# EAGLE schematic Detectielus schema (EAGLE 9.2.2)
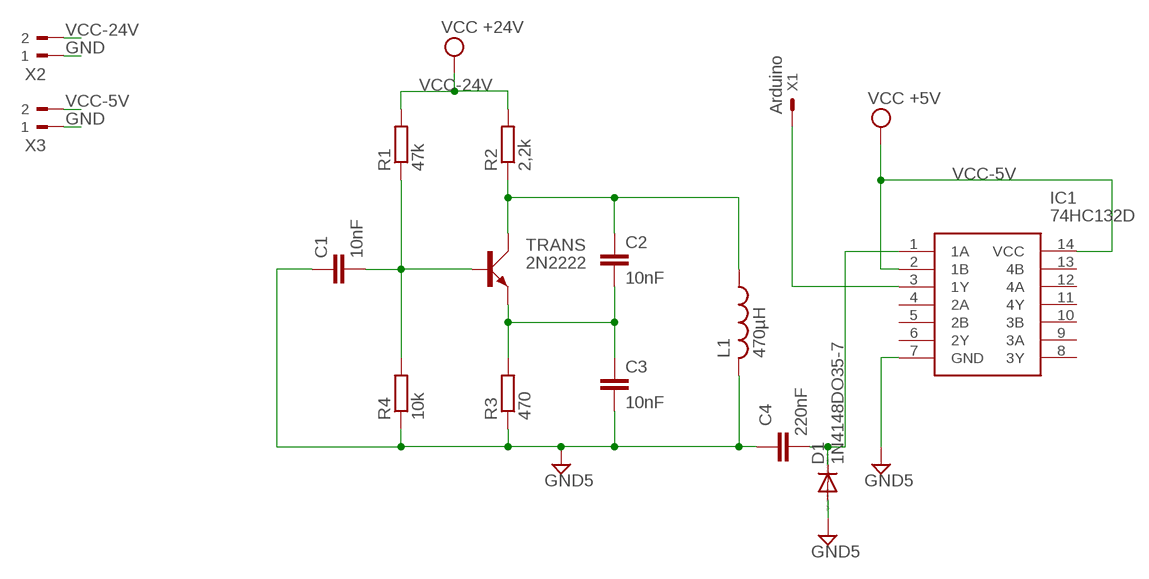
[diagram p0: schematic, sheet 1]

## Parts
C1  10nF  CAPACITOR  [C050-024X044]
C2  10nF  CAPACITOR  [C050-024X044]
C3  10nF  CAPACITOR  [C050-024X044]
C4  220nF  CAPACITOR  [C050-024X044]
D1  1N4148DO35-7  [DO35-7]
IC1  74HC132D  [SOIC127P600X175-14N]
L1  470µH  SPOEL  [IR-4]
R1  47k  RESISTOR  [RDH/15]
R2  2,2k  RESISTOR  [RDH/15]
R3  470  RESISTOR  [RDH/15]
R4  10k  RESISTOR  [RDH/15]
TRANS  2N2222  TIP41C  [TO220AV]
X1  Arduino  332-02  [332-02]
X2  90-2  [90-2]
X3  90-2  [90-2]

## Nets
GND: X2.1 X3.1
GND5: C1.1 C3.2 C4.1 D1.A IC1.7(GND) L1.2 R3.1 R4.1
N$1: C4.2 D1.C IC1.1(1A)
N$2: C1.2 R1.1 R4.2 TRANS.B
N$3: C2.2 C3.1 R3.2 TRANS.E
N$4: C2.1 L1.1 R2.1 TRANS.C
N$9: IC1.3(1Y) X1.1(S)
VCC-5V: IC1.2(1B) IC1.14(VCC) X3.2 ; supply symbol labelled VCC +5V
VCC-24V: R1.2 R2.2 X2.2 ; supply symbol labelled VCC +24V
Unconnected: IC1.4(2A) IC1.5(2B) IC1.6(2Y) IC1.8(3Y) IC1.9(3A) IC1.10(3B) IC1.11(4Y) IC1.12(4A) IC1.13(4B)

## Library data of the parts
C1-C4 = Detectielus library:CAPACITOR
D1 = Detectielus library:1N4148: DIODE high speed (Philips)
IC1 = Detectielus library:74HC132D: 74HC132D, Logic Gate Quad 2 Input NAND, HC, 5.2mA 2 to 6V 14-Pin SOIC Source: Datasheet <http://www.nxp.com/documents/data_sheet/74HC_HCT132.pdf>; ARROW_PART_NUMBER: 74HC132D; ARROW_PRICE-STOCK: http://uk.rs-online.com/web/p/products/4367408; DESCRIPTION: 74HC132D, Logic Gate Quad 2 Input NAND, HC, 5.2mA 2 to 6V 14-Pin SOIC; HEIGHT: 1.75mm; MANUFACTURER_NAME: Nexperia; MANUFACTURER_PART_NUMBER: 74HC132D; RS_PART_NUMBER: 4367408; RS_PRICE-STOCK: http://uk.rs-online.com/web/p/products/4367408
L1 = Detectielus library:SPOEL
R1-R4 = Detectielus library:RESISTOR
TRANS = Detectielus library:TIP41C: NPN TRANSISTOR
X1 = Detectielus library:332-02: 2 Pin - 2mm Dual Row Source: www.mpe-connector.de / garry_shortform_2012.pdf
X2 X3 = Detectielus library:90-2: WEIDMUELLER CLAMP CONNECTOR; OC_FARNELL: unknown; OC_NEWARK: unknown